# Altium schematic sheet Sheet1.SchDoc
size A; SheetNumber: 1; SheetTotal: 1
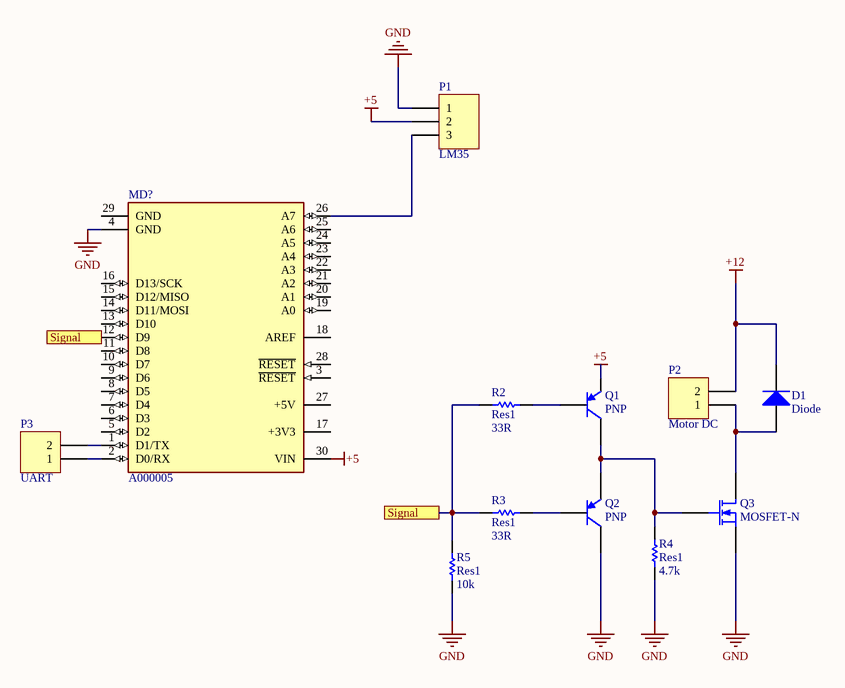
[diagram p0: Sheet1.SchDoc]

## Parts
D1  Diode  [SMC]
MD?  A000005  [FP-A000005-MFG]
P1  LM35  [HDR1X3]
P2  Motor DC  [HDR1X2]
P3  UART  [HDR1X2]
Q1  PNP  [SOT-23B_N]
Q2  PNP  [SOT-23B_N]
Q3  MOSFET-N  [E3]
R2  Res1  value 33R  [AXIAL-0.3]
R3  Res1  value 33R  [AXIAL-0.3]
R4  Res1  value 4.7k  [AXIAL-0.3]
R5  Res1  value 10k  [AXIAL-0.3]

## Ports
Signal

## Nets
+5: MD?.30(VIN) P1.2 Q1.3(E)
+12: D1.2(K) P2.2
GND: MD?.4(GND) P1.1 Q2.1(C) Q3.3(S) R4.1 R5.1
Signal: MD?.12(D9) R2.1 R3.1 R5.2 ; port Signal
NetD1_1: D1.1(A) P2.1 Q3.1(D)
NetMD?_1: MD?.1(D1/TX) P3.2
NetMD?_2: MD?.2(D0/RX) P3.1
NetMD?_26: MD?.26(A7) P1.3
NetQ1_1: Q1.1(C) Q2.3(E) Q3.2(G) R4.2
NetQ1_2: Q1.2(B) R2.2
NetQ2_2: Q2.2(B) R3.2

Not connected (* = marked no-connect by the designer): MD? 3(~{RESET}) 5(D2) 6(D3) 7(D4) 8(D5) 9(D6) 10(D7) 11(D8) 13(D10) 14(D11/MOSI) 15(D12/MISO) 16(D13/SCK) 17(+3V3) 18(AREF) 19(A0) 20(A1) 21(A2) 22(A3) 23(A4) 24(A5) 25(A6) 27(+5V) 28(~{RESET}) 29(GND)

## Library data of the parts
D1 = Diode: Default Diode; Published: 8-Jun-2000; LatestRevisionDate: 17-Jul-2002; LatestRevisionNote: Re-released for DXP Platform.; PackageVersion: Sep-1996; PackageReference: SMC; Publisher: Altium Limited; PackageDescription: DO-214-AB/SMC; 2 C-Bend Leads; Body 7.9 x 5.9 mm, inc. leads (LxW); Code_JEDEC: DO-214-AB
MD? = CMP-189986-000002-1: ARDUINO NANO ATMEGA328 EVAL BRD; Number of Bits: 8; Evaluation Kit: Yes; Operating Supply Voltage: 12V; Interface: I2C; Data Bus Width: 8b; Core Architecture: AVR; Packaging: Bulk; Length: 7inch; Package Quantity: 50; Width: 5inch; REACH SVHC: No SVHC; Weight: 0.358383oz; Series: AVR® ATmega; Height: 0.25inch
P1 = Header 3: Header, 3-Pin; LatestRevisionDate: 17-Jul-2002; LatestRevisionNote: Re-released for DXP Platform.; Publisher: Altium Limited
P2 P3 = Header 2: Header, 2-Pin; LatestRevisionDate: 17-Jul-2002; LatestRevisionNote: Re-released for DXP Platform.; Publisher: Altium Limited
Q1 Q2 = PNP: PNP Bipolar Transistor; Published: 8-Jun-2000; LatestRevisionDate: 29-May-2009; LatestRevisionNote: IPC-7351 Footprint Added.; PackageVersion: Aug-1999; PackageReference: SOT-23B; Publisher: Altium Limited; PackageDescription: 3-Pin SOT-23 Package 0.95 mm Pitch, 2.4 mm Lead Span
Q3 = MOSFET-N: N-Channel MOSFET; Published: 8-Jun-2000; LatestRevisionDate: 17-Jul-2002; LatestRevisionNote: Re-released for DXP Platform.; PackageVersion: 1995/1996; PackageReference: E3; Publisher: Altium Limited; PackageDescription: TO, Flat Index; 3 In-Line, Axial Leads; Body Dia. 4.6mm; Lead Dia. 0.5 mm (max)
R2-R5 = Res1: Resistor; Published: 8-Jun-2000; LatestRevisionDate: 17-Jul-2002; LatestRevisionNote: Re-released for DXP Platform.; PackageReference: AXIAL-0.3; Publisher: Altium Limited; PackageDescription: Axial Device, Thru-Hole; 2 Leads; 0.3 in Pin Spacing